# Altium schematic sheet [1]-MCU_LPC1777.SchDoc
size A3; SheetNumber: 2; SheetTotal: 8
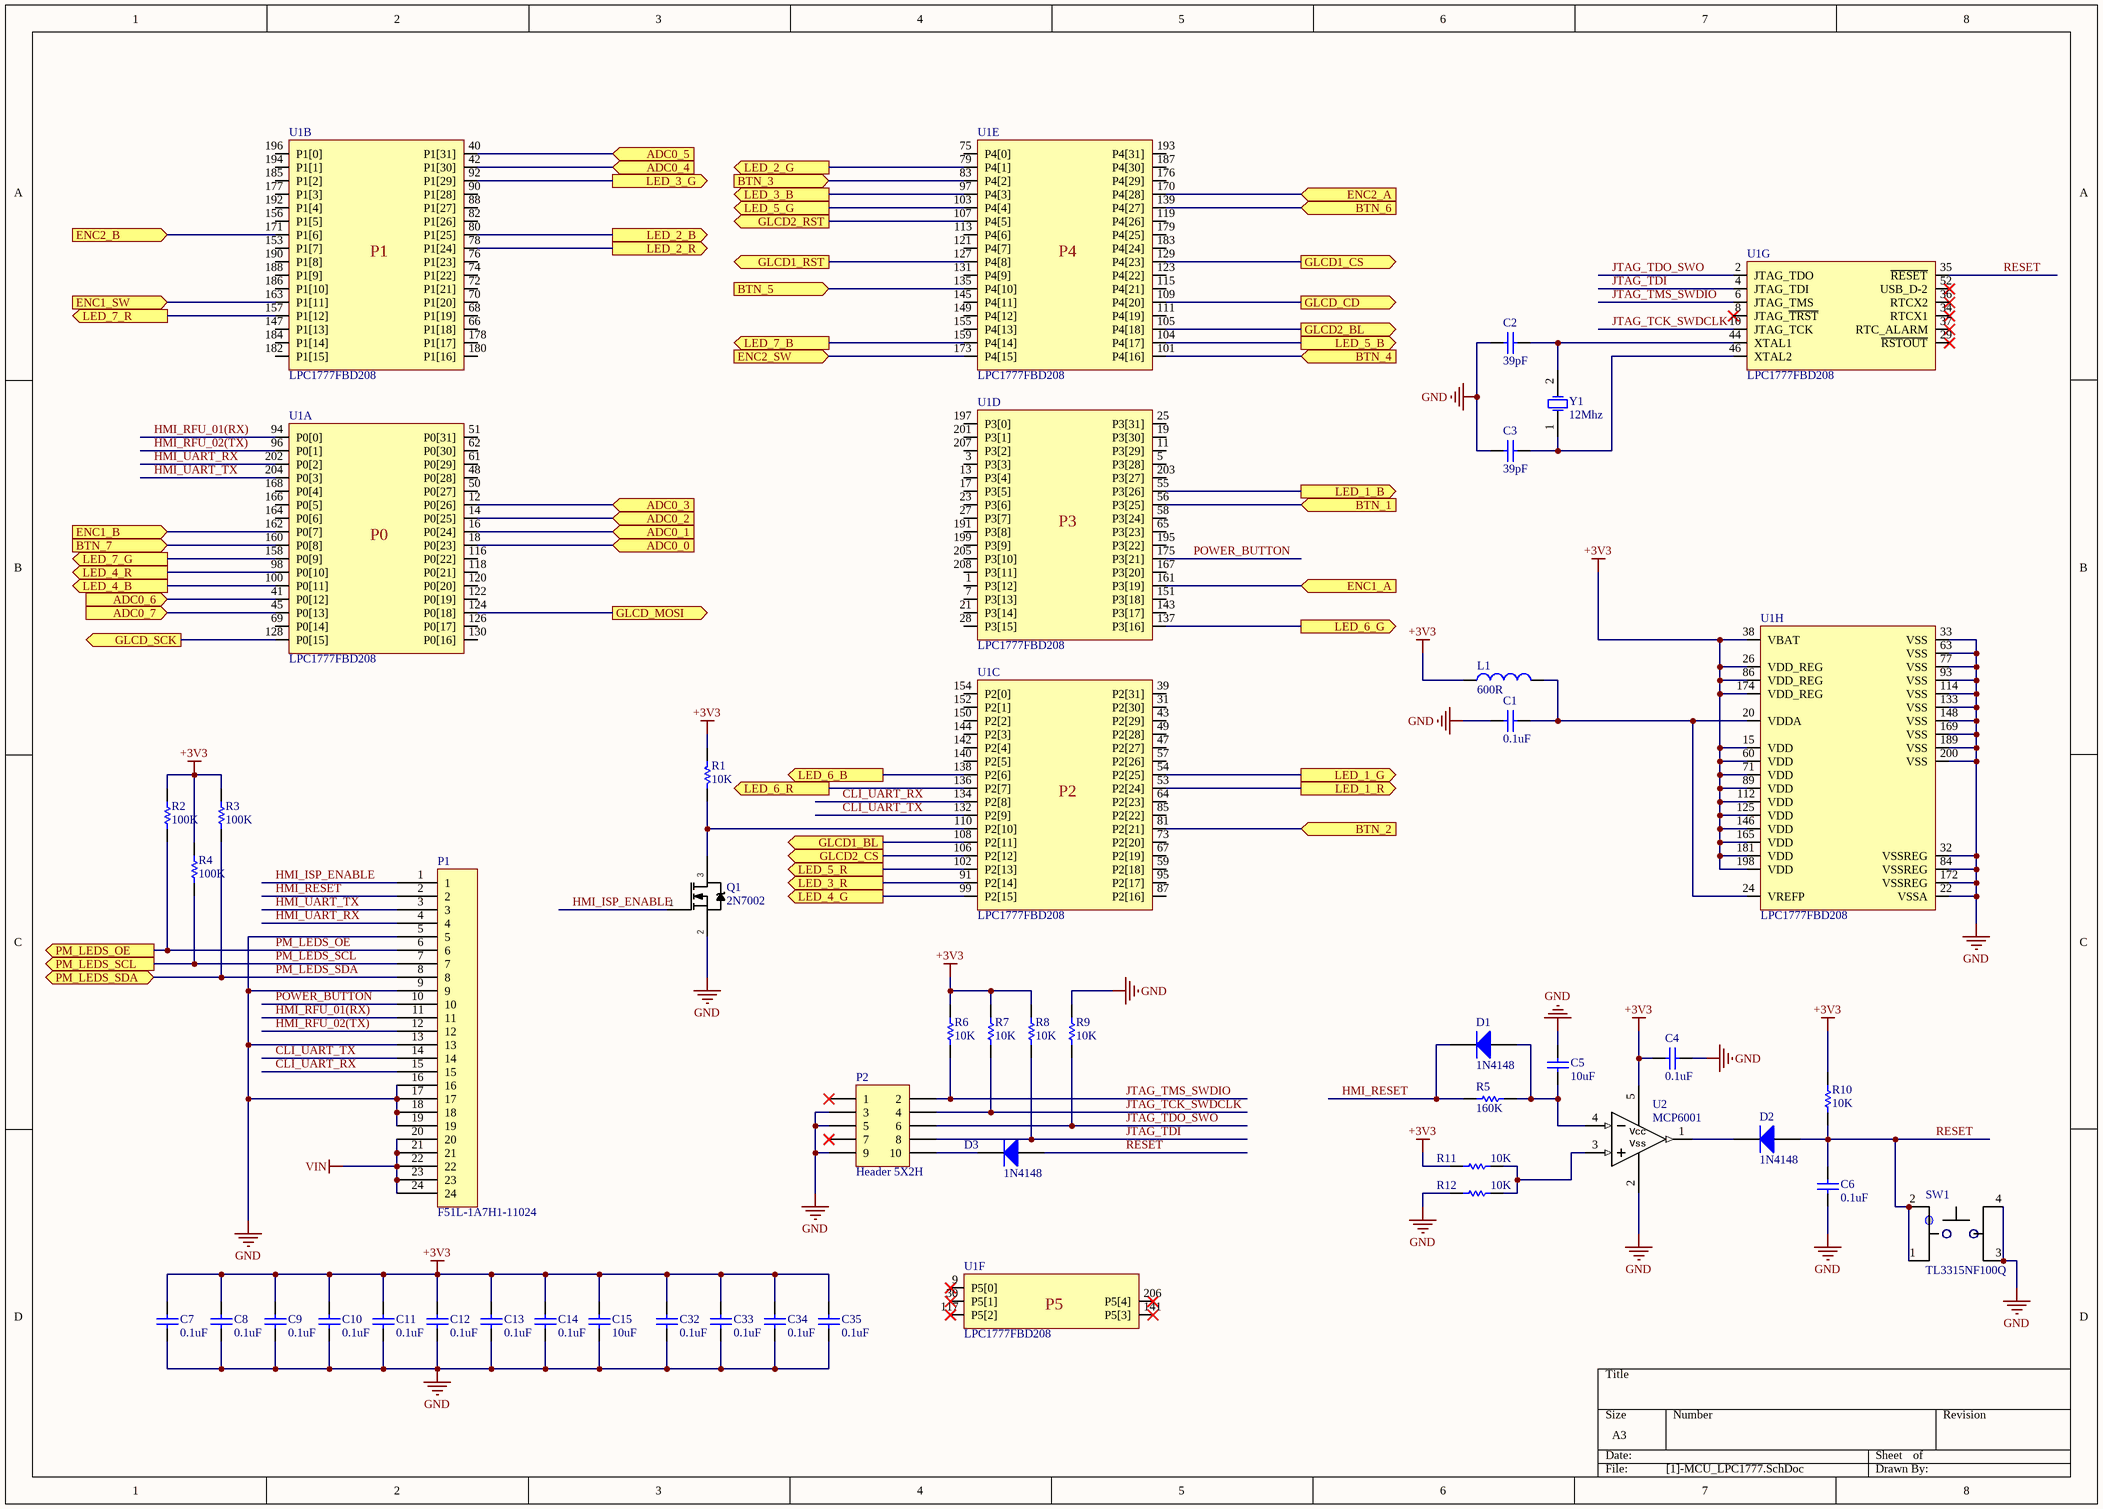
[diagram p0: [1]-MCU_LPC1777.SchDoc]

## Parts
C1  0.1uF  [CAPC1005N]
C2  39pF  [CAPC1608N]
C3  39pF  [CAPC1608N]
C4  0.1uF  [CAPC1608N]
C5  10uF  [CAPC1608N]
C6  0.1uF  [CAPC1608N]
C7  0.1uF  [CAPC1005N]
C8  0.1uF  [CAPC1005N]
C9  0.1uF  [CAPC1005N]
C10  0.1uF  [CAPC1005N]
C11  0.1uF  [CAPC1005N]
C12  0.1uF  [CAPC1005N]
C13  0.1uF  [CAPC1005N]
C14  0.1uF  [CAPC1005N]
C15  10uF  [CAPC1608N]
C32  0.1uF  [CAPC1005N]
C33  0.1uF  [CAPC1005N]
C34  0.1uF  [CAPC1005N]
C35  0.1uF  [CAPC1005N]
D1  1N4148  [SOD-323]
D2  1N4148  [SOD-323]
D3  1N4148  [SOD-323]
L1  600R  [INDC1608N]
P1  F51L-1A7H1-11024  [F51L-1A7H1-11024]
P2  Header 5X2H  [HDR2x5_1P27]
Q1  2N7002  [SOT23-3N]
R1  10K  [RESC1608N]
R2  100K  [RESC1608N]
R3  100K  [RESC1608N]
R4  100K  [RESC1608N]
R5  160K  [RESC1608N]
R6  10K  [RESC1608N]
R7  10K  [RESC1608N]
R8  10K  [RESC1608N]
R9  10K  [RESC1608N]
R10  10K  [RESC1608N]
R11  10K  [RESC1608N]
R12  10K  [RESC1608N]
SW1  TL3315NF100Q  [TL3315]
U1  LPC1777FBD208  [LQFP-208]  (parts A,B,C,D,E,F,G,H of 8)
U2  MCP6001  [SOT23-5N]
Y1  12Mhz  [CRYSTAL_HC49SDLF]

## Ports
ADC0_0 (in), ADC0_1 (in), ADC0_2 (in), ADC0_3 (in), ADC0_4 (in), ADC0_5 (in), ADC0_6 (in), ADC0_7 (in), BTN_1 (in), BTN_2 (in), BTN_3 (in), BTN_4 (in), BTN_5 (in), BTN_6 (in), BTN_7 (in), ENC1_A (in), ENC1_B (in), ENC1_SW (in), ENC2_A (in), ENC2_B (in), ENC2_SW (in), GLCD1_BL (out), GLCD1_CS (out), GLCD1_RST (out), GLCD2_BL (out), GLCD2_CS (out), GLCD2_RST (out), GLCD_CD (out), GLCD_MOSI (out), GLCD_SCK (out), LED_1_B (out), LED_1_G (out), LED_1_R (out), LED_2_B (out), LED_2_G (out), LED_2_R (out), LED_3_B (out), LED_3_G (out), LED_3_R (out), LED_4_B (out), LED_4_G (out), LED_4_R (out), LED_5_B (out), LED_5_G (out), LED_5_R (out), LED_6_B (out), LED_6_G (out), LED_6_R (out), LED_7_B (out), LED_7_G (out), LED_7_R (out), PM_LEDS_OE (out), PM_LEDS_SCL (out), PM_LEDS_SDA (bidir)

## Nets
+3V3: C4.2 C7.2 C8.2 C9.2 C10.2 C11.2 C12.2 C13.2 C14.2 C15.2 C32.2 C33.2 C34.2 C35.2 L1.2 R1.1 R2.2 R3.2 R4.2 R6.1 R7.1 R8.1 R10.1 R11.2 U1.15(VDD) U1.26(VDD_REG) U1.38(VBAT) U1.60(VDD) U1.71(VDD) U1.86(VDD_REG) U1.89(VDD) U1.112(VDD) U1.125(VDD) U1.146(VDD) U1.165(VDD) U1.174(VDD_REG) U1.181(VDD) U1.198(VDD) U2.5(VCC)
GND: C1.2 C2.2 C3.1 C4.1 C5.1 C6.2 C7.1 C8.1 C9.1 C10.1 C11.1 C12.1 C13.1 C14.1 C15.1 C32.1 C33.1 C34.1 C35.1 P1.5 P1.9 P1.13 P1.16 P1.17 P1.18 P1.19 P2.3 P2.5 P2.9 Q1.2(S) R9.1 R12.2 SW1.3 SW1.4 U1.22(VSSA) U1.32(VSSREG) U1.33(VSS) U1.63(VSS) U1.77(VSS) U1.84(VSSREG) U1.93(VSS) U1.114(VSS) U1.133(VSS) U1.148(VSS) U1.169(VSS) U1.172(VSSREG) U1.189(VSS) U1.200(VSS) U2.2(VSS)
VIN: P1.20 P1.21 P1.22 P1.23 P1.24
ADC0_0: U1.18(P0[23]) ; port ADC0_0
ADC0_1: U1.16(P0[24]) ; port ADC0_1
ADC0_2: U1.14(P0[25]) ; port ADC0_2
ADC0_3: U1.12(P0[26]) ; port ADC0_3
ADC0_4: U1.42(P1[30]) ; port ADC0_4
ADC0_5: U1.40(P1[31]) ; port ADC0_5
ADC0_6: U1.41(P0[12]) ; port ADC0_6
ADC0_7: U1.45(P0[13]) ; port ADC0_7
BTN_1: U1.56(P3[25]) ; port BTN_1
BTN_2: U1.81(P2[21]) ; port BTN_2
BTN_3: U1.83(P4[2]) ; port BTN_3
BTN_4: U1.101(P4[16]) ; port BTN_4
BTN_5: U1.135(P4[10]) ; port BTN_5
BTN_6: U1.139(P4[27]) ; port BTN_6
BTN_7: U1.160(P0[8]) ; port BTN_7
CLI_UART_RX: P1.15 U1.134(P2[8])
CLI_UART_TX: P1.14 U1.132(P2[9])
ENC1_A: U1.161(P3[19]) ; port ENC1_A
ENC1_B: U1.162(P0[7]) ; port ENC1_B
ENC1_SW: U1.163(P1[11]) ; port ENC1_SW
ENC2_A: U1.170(P4[28]) ; port ENC2_A
ENC2_B: U1.171(P1[6]) ; port ENC2_B
ENC2_SW: U1.173(P4[15]) ; port ENC2_SW
GLCD1_BL: U1.108(P2[11]) ; port GLCD1_BL
GLCD1_CS: U1.129(P4[23]) ; port GLCD1_CS
GLCD1_RST: U1.127(P4[8]) ; port GLCD1_RST
GLCD2_BL: U1.105(P4[18]) ; port GLCD2_BL
GLCD2_CS: U1.106(P2[12]) ; port GLCD2_CS
GLCD2_RST: U1.107(P4[5]) ; port GLCD2_RST
GLCD_CD: U1.109(P4[20]) ; port GLCD_CD
GLCD_MOSI: U1.124(P0[18]) ; port GLCD_MOSI
GLCD_SCK: U1.128(P0[15]) ; port GLCD_SCK
HMI_ISP_ENABLE: P1.1 Q1.1(G)
HMI_RESET: D1.1(K) P1.2 R5.1
HMI_RFU_01(RX): P1.11 U1.94(P0[0])
HMI_RFU_02(TX): P1.12 U1.96(P0[1])
HMI_UART_RX: P1.4 U1.202(P0[2])
HMI_UART_TX: P1.3 U1.204(P0[3])
JTAG_TCK_SWDCLK: P2.4 R7.2 U1.10(JTAG_TCK)
JTAG_TDI: P2.8 R8.2 U1.4(JTAG_TDI)
JTAG_TDO_SWO: P2.6 R9.2 U1.2(JTAG_TDO)
JTAG_TMS_SWDIO: P2.2 R6.2 U1.6(JTAG_TMS)
LED_1_B: U1.55(P3[26]) ; port LED_1_B
LED_1_G: U1.54(P2[25]) ; port LED_1_G
LED_1_R: U1.53(P2[24]) ; port LED_1_R
LED_2_B: U1.80(P1[25]) ; port LED_2_B
LED_2_G: U1.79(P4[1]) ; port LED_2_G
LED_2_R: U1.78(P1[24]) ; port LED_2_R
LED_3_B: U1.97(P4[3]) ; port LED_3_B
LED_3_G: U1.92(P1[29]) ; port LED_3_G
LED_3_R: U1.91(P2[14]) ; port LED_3_R
LED_4_B: U1.100(P0[11]) ; port LED_4_B
LED_4_G: U1.99(P2[15]) ; port LED_4_G
LED_4_R: U1.98(P0[10]) ; port LED_4_R
LED_5_B: U1.104(P4[17]) ; port LED_5_B
LED_5_G: U1.103(P4[4]) ; port LED_5_G
LED_5_R: U1.102(P2[13]) ; port LED_5_R
LED_6_B: U1.138(P2[6]) ; port LED_6_B
LED_6_G: U1.137(P3[16]) ; port LED_6_G
LED_6_R: U1.136(P2[7]) ; port LED_6_R
LED_7_B: U1.159(P4[14]) ; port LED_7_B
LED_7_G: U1.158(P0[9]) ; port LED_7_G
LED_7_R: U1.157(P1[12]) ; port LED_7_R
PM_LEDS_OE: P1.6 R2.1 ; port PM_LEDS_OE
PM_LEDS_SCL: P1.7 R4.1 ; port PM_LEDS_SCL
PM_LEDS_SDA: P1.8 R3.1 ; port PM_LEDS_SDA
POWER_BUTTON: P1.10 U1.175(P3[21])
RESET: C6.1 D2.2(A) D3.2(A) R10.2 SW1.1 SW1.2 U1.35(~{RESET})
NetC1_1: C1.1 L1.1 U1.20(VDDA) U1.24(VREFP)
NetC2_1: C2.1 U1.44(XTAL1) Y1.2(OSC2)
NetC3_2: C3.2 U1.46(XTAL2) Y1.1(OSC1)
NetC5_2: C5.2 D1.2(A) R5.2 U2.4(IN-)
NetD2_1: D2.1(K) U2.1(OUT)
NetD3_1: D3.1(K) P2.10
NetQ1_3: Q1.3(D) R1.2 U1.110(P2[10])
NetR11_1: R11.1 R12.1 U2.3(IN+)

Not connected (* = marked no-connect by the designer): P2 1* 7*; U1 1(P3[12]) 3(P3[3]) 5(P3[28]) 7(P3[13]) 8(JTAG_~{TRST})* 9(P5[0])* 11(P3[29]) 13(P3[4]) 17(P3[5]) 19(P3[30]) 21(P3[14]) 23(P3[6]) 25(P3[31]) 27(P3[7]) 28(P3[15]) 29(~{RSTOUT})* 30(P5[1])* 31(P2[30]) 34(RTCX1)* 36(RTCX2)* 37(RTC_ALARM)* 39(P2[31]) 43(P2[29]) 47(P2[27]) 48(P0[28]) 49(P2[28]) 50(P0[27]) 51(P0[31]) 52(USB_D-2)* 57(P2[26]) 58(P3[24]) 59(P2[18]) 61(P0[29]) 62(P0[30]) 64(P2[23]) 65(P3[23]) 66(P1[18]) 67(P2[19]) 68(P1[19]) 69(P0[14]) 70(P1[20]) 72(P1[21]) 73(P2[20]) 74(P1[22]) 75(P4[0]) 76(P1[23]) 82(P1[26]) 85(P2[22]) 87(P2[16]) 88(P1[27]) 90(P1[28]) 95(P2[17]) 111(P4[19]) 113(P4[6]) 115(P4[21]) 116(P0[22]) 117(P5[2])* 118(P0[21]) 119(P4[26]) 120(P0[20]) 121(P4[7]) 122(P0[19]) 123(P4[22]) 126(P0[17]) 130(P0[16]) 131(P4[9]) 140(P2[5]) 141(P5[3])* 142(P2[4]) 143(P3[17]) 144(P2[3]) 145(P4[11]) 147(P1[13]) 149(P4[12]) 150(P2[2]) 151(P3[18]) 152(P2[1]) 153(P1[7]) 154(P2[0]) 155(P4[13]) 156(P1[5]) 164(P0[6]) 166(P0[5]) 167(P3[20]) 168(P0[4]) 176(P4[29]) 177(P1[3]) 178(P1[17]) 179(P4[25]) 180(P1[16]) 182(P1[15]) 183(P4[24]) 184(P1[14]) 185(P1[2]) 186(P1[10]) 187(P4[30]) 188(P1[9]) 190(P1[8]) 191(P3[8]) 192(P1[4]) 193(P4[31]) 194(P1[1]) 195(P3[22]) 196(P1[0]) 197(P3[0]) 199(P3[9]) 201(P3[1]) 203(P3[27]) 205(P3[10]) 206(P5[4])* 207(P3[2]) 208(P3[11])

## Notes on the sheet
- (in symbol IC_LPC1777FBD208,551, part A) P0
- (in symbol IC_LPC1777FBD208,551, part B) P1
- (in symbol IC_LPC1777FBD208,551, part C) P2
- (in symbol IC_LPC1777FBD208,551, part D) P3
- (in symbol IC_LPC1777FBD208,551, part E) P4
- (in symbol IC_LPC1777FBD208,551, part F) P5
- (in symbol IC_MCP6001T-I/OT) Vcc; Vss

## Library data of the parts
C1 C7-C14 C32-C35 = GRM155R71H104KE14D: CAP CER 0.1UF 50V X7R 0402; Manufacturer 1: Murata; Description 1: Cap Ceramic 0.1uF 50V X7R 10% SMD 0402 125C Paper T/R; Voltage Rating DC: 50 VDC; Tolerance: 10 %; Brand: Murata Electronics; Capacitance - nF: 100 nF; Capacitance - pF: 100000 pF; Class: Class 2; Type: General Purpose Ceramic Capacitors; Unit Weight: 0.000212 oz; Supplier 1: Digi-Key; Manufacturer Part Number 1: GRM155R71H104KE14D; Stock 1: 0; Pricing 1: 1=0.1, 10=0.022, 100=0.0099, 500=0.0071, 1000=0.0056, 2500=0.0051, 5000=0.0047 (USD); Product Category: Multilayer Ceramic Capacitors MLCC - SMD/SMT; RoHS: True; Capacitance: 0.1 uF; Dielectric: X7R; Case Code - in: 0402; Case Code - mm: 1005; Height: 0.5 mm; Maximum Operating Temperature: + 125 C; Minimum Operating Temperature: - 55 C; Product: General Type MLCCs; Series: GRM; Packaging: Reel; Length: 1 mm; Package / Case: 0402 (1005 metric); Factory Pack Quantity: 10000; Termination Style: SMD/SMT; Width: 0.5 mm; ComponentLink1URL: http://components.arrow.com/part/dataview/0323_07030614; ComponentLink1Description: http://components.arrow.com/part/dataview/0323_07030614; ComponentLink2URL: http://psearch.en.murata.com/capacitor/product/GRM155R71H104KE14%23.pdf; ComponentLink2Description: http://psearch.en.murata.com/capacitor/product/GRM155R71H104KE14%23.pdf; ComponentLink3URL: http://www.mouser.com/ds/2/281/c02e-2905.pdf; ComponentLink3Description: http://www.mouser.com/ds/2/281/c02e-2905.pdf; ComponentLink4URL: http://search.murata.co.jp/Ceramy/image/img/A01X/partnumbering_e_01.pdf; ComponentLink4Description: http://search.murata.co.jp/Ceramy/image/img/A01X/partnumbering_e_01.pdf; ComponentLink5URL: http://www.farnell.com/datasheets/2079156.pdf; ComponentLink5Description: http://www.farnell.com/datasheets/2079156.pdf; Supplier Part Number 1: 490-10700-1-ND
C2 C3 = C1608NP01H390J080AA: CAP CER 39PF 50V NP0 0603; Manufacturer 1: TDK; Tolerance: 5%; Dielectric: C0G; Supplier 1: Digi-Key; Manufacturer Part Number 1: C1608NP01H390J080AA; Stock 1: 1503; Pricing 1: 1=0.15, 10=0.106, 100=0.05, 500=0.03508, 1000=0.02904 (USD); Mount: Surface Mount; Case/Package: 0603; Weight: 7.1E-05oz; Case Code (Metric): 1608; Case Code (Imperial): 0603; Min Operating Temperature: -55°C; Max Operating Temperature: 150°C; Package Quantity: 4000; Packaging: Tape and Reel; Capacitance: 39pF; Voltage Rating: 50V; Termination: SMD/SMT; Voltage Rating (DC): 50V; Length: 0.063inch; Height: 0.8mm; Width: 0.031inch; Thickness: 0.035inch; Supplier Part Number 1: 445-14077-1-ND
C4 C6 = CC0603KRX7R8BB104: CAP CER 0.1UF 25V X7R 0603; Manufacturer 1: Yageo; Capacitance: 100nF; Tolerance: 10%; Supplier 1: Digi-Key; Manufacturer Part Number 1: CC0603KRX7R8BB104; Stock 1: 40000; Pricing 1: 1=0.1, 10=0.074, 100=0.0329, 500=0.02352, 1000=0.01848 (USD); Mount: Surface Mount; Case/Package: 0603; Number of Pins: 2; Case Code (Imperial): 0603; Case Code (Metric): 1608; Min Operating Temperature: -55°C; Max Operating Temperature: 125°C; Dielectric: X7R; Voltage Rating: 25V; Packaging: Tape and Reel; Package Quantity: 1; Voltage Rating (DC): 25V; Termination: SMD/SMT; Composition: Ceramic; Voltage: 25V; Length: 1.6mm; Height: 0.8mm; Width: 0.8mm; Thickness: 0.035inch; Depth: 0.8mm; Radiation Hardening: No; REACH SVHC: Unknown; Lead Free: Lead Free; Halogen Free: Halogen Free; ComponentLink1URL: https://datasheet.ciiva.com/11786/0900766b80c10176-11786120.pdf; ComponentLink1Description: https://datasheet.ciiva.com/11786/0900766b80c10176-11786120.pdf; ComponentLink2URL: https://datasheet.ciiva.com/144/mlccorderingcode-144075.pdf; ComponentLink2Description: https://datasheet.ciiva.com/144/mlccorderingcode-144075.pdf; ComponentLink3URL: https://datasheet.ciiva.com/17434/upy-gphc-x7r-6-3v-to-50v-8-17434263.pdf; ComponentLink3Description: https://datasheet.ciiva.com/17434/upy-gphc-x7r-6-3v-to-50v-8-17434263.pdf; ComponentLink4URL: https://datasheet.ciiva.com/26829/getdatasheetpartid-403577-26829431.pdf; ComponentLink4Description: https://datasheet.ciiva.com/26829/getdatasheetpartid-403577-26829431.pdf; ComponentLink5URL: https://datasheet.ciiva.com/11587/upy-gphc-x7r-6-3v-to-50v-8-11587208.pdf; ComponentLink5Description: https://datasheet.ciiva.com/11587/upy-gphc-x7r-6-3v-to-50v-8-11587208.pdf; ComponentLink6URL: https://datasheet.ciiva.com/13389/upy-gphc-x7r-6-3v-to-50v-8-13389352.pdf; ComponentLink6Description: https://datasheet.ciiva.com/13389/upy-gphc-x7r-6-3v-to-50v-8-13389352.pdf; ComponentLink7URL: https://datasheet.ciiva.com/28450/1489800-28450584.pdf; ComponentLink7Description: https://datasheet.ciiva.com/28450/1489800-28450584.pdf; ComponentLink8URL: https://datasheet.ciiva.com/144/mlccorderingcode-144073.pdf; ComponentLink8Description: https://datasheet.ciiva.com/144/mlccorderingcode-144073.pdf; ComponentLink9URL: https://datasheet.ciiva.com/144/mlccorderingcode-144074.pdf; ComponentLink9Description: https://datasheet.ciiva.com/144/mlccorderingcode-144074.pdf; ComponentLink10URL: https://datasheet.ciiva.com/7978/1489800-7978155.pdf; ComponentLink10Description: https://datasheet.ciiva.com/7978/1489800-7978155.pdf; Supplier Part Number 1: 311-1341-1-ND
C5 C15 = GRM188R61A106KE69D: CAP CER 10UF 10V X5R 0603; Manufacturer 1: Murata; Tolerance: 10%; Supplier 1: Digi-Key; Manufacturer Part Number 1: GRM188R61A106KE69D; Stock 1: 40000; Pricing 1: 1=0.22, 10=0.149, 100=0.0754, 500=0.05158, 1000=0.04563 (USD); Mount: Surface Mount; Case/Package: 0603; Case Code (Metric): 1608; Case Code (Imperial): 0603; Min Operating Temperature: -55°C; Max Operating Temperature: 85°C; Capacitance: 10uF; Packaging: Tape and Reel; Dielectric: X5R; Voltage Rating: 10V; Voltage: 10V; Voltage Rating (DC): 10V; Length: 1.6mm; Height: 0.8mm; Width: 0.031inch; Thickness: 0.037inch; Depth: 0.8mm; REACH SVHC: No SVHC; Lead Free: Lead Free; Supplier Part Number 1: 490-10474-1-ND
D1-D3 = 1N4148WS-7-F: DIODE SWITCHING 75V 0.15A SOD323; Manufacturer 1: Diodes; Forward Current: 300mA; Reverse Recovery Time: 4ns; Element Configuration: Single; Forward Voltage: 1.25V; Peak Reverse Current: 1uA; Peak Non-Repetitive Surge Current: 2A; Average Rectified Current: 150mA; Power Dissipation: 200mW; Polarity: Standard; Capacitance: 2pF; Supplier 1: Digi-Key; Manufacturer Part Number 1: 1N4148WS-7-F; Stock 1: 557451; Pricing 1: 1=0.19, 10=0.171, 100=0.0932, 500=0.05736, 1000=0.03911 (USD); Mount: Surface Mount; Number of Pins: 2; Weight: 0.000173oz; Contact Plating: Tin,Matte; Min Operating Temperature: -65°C; Max Operating Temperature: 150°C; Max Repetitive Reverse Voltage (Vrrm): 75V; Max Forward Surge Current (Ifsm): 2A; Max Surge Current: 2A; Packaging: Tape and Reel; Recovery Time: 4ns; Package Quantity: 3000; Voltage Rating (DC): 75V; Power Rating: 200mW; Current Rating: 150mA; Output Current: 150mA; Voltage: 75V; Max Reverse Voltage (DC): 75V; Current: 2A; Length: 1.8mm; Height: 1mm; Width: 1.4mm; Radiation Hardening: No; REACH SVHC: No SVHC; Lead Free: Lead Free; ComponentLink1URL: https://datasheet.ciiva.com/16199/ds30097-16199061.pdf; ComponentLink1Description: https://datasheet.ciiva.com/16199/ds30097-16199061.pdf; ComponentLink2URL: https://datasheet.ciiva.com/16472/ds30097-16472599.pdf; ComponentLink2Description: https://datasheet.ciiva.com/16472/ds30097-16472599.pdf; ComponentLink3URL: https://datasheet.ciiva.com/1179/ds30097-1179355.pdf; ComponentLink3Description: https://datasheet.ciiva.com/1179/ds30097-1179355.pdf; ComponentLink4URL: https://datasheet.ciiva.com/8300/ds30097-8300396.pdf; ComponentLink4Description: https://datasheet.ciiva.com/8300/ds30097-8300396.pdf; ComponentLink5URL: https://datasheet.ciiva.com/911/ds30097-911741.pdf; ComponentLink5Description: https://datasheet.ciiva.com/911/ds30097-911741.pdf; ComponentLink6URL: https://datasheet.ciiva.com/911/ds30097-911742.pdf; ComponentLink6Description: https://datasheet.ciiva.com/911/ds30097-911742.pdf; ComponentLink7URL: https://datasheet.ciiva.com/25946/ds30097-25946926.pdf; ComponentLink7Description: https://datasheet.ciiva.com/25946/ds30097-25946926.pdf; ComponentLink8URL: https://datasheet.ciiva.com/911/ds30097-911743.pdf; ComponentLink8Description: https://datasheet.ciiva.com/911/ds30097-911743.pdf; Supplier Part Number 1: 1N4148WS-FDICT-ND
L1 = 742792651: FERRITE BEAD 600 OHM 1.0A 0603; Manufacturer 1: Wurth Electronics; Tolerance: 25%; Current Rating: 1A; Number of Lines: 1; DC Resistance (DCR): 200mR; Test Frequency: 100MHz; Inductance: 0.36h; Supplier 1: Digi-Key; Manufacturer Part Number 1: 742792651; Description 1: FERRITE BEAD 600 OHM 1.0A 0603; Stock 1: 281795; Pricing 1: 1=0.17, 50=0.168, 100=0.155, 500=0.148, 1000=0.141, 2000=0.134 (USD); Mount: Surface Mount; Case/Package: SMD/SMT; Weight: 0.000141oz; Case Code (Metric): 1608; Case Code (Imperial): 0603; Material: Ferrite; Core Material: Ferrite; Min Operating Temperature: -55°C; Max Operating Temperature: 125°C; Package Quantity: 1; Packaging: Tape and Reel; Impedance: 600R; Max Current Rating: 1A; Max DC Current: 1A; Termination: SMD/SMT; Resistance: 200mR; Length: 1.6mm; Height: 0.8mm; Width: 0.8mm; Depth: 0.8mm; REACH SVHC: Unknown; Lead Free: Lead Free; ComponentLink1URL: https://datasheet.ciiva.com/11803/0900766b80d2e079-11803680.pdf; ComponentLink1Description: https://datasheet.ciiva.com/11803/0900766b80d2e079-11803680.pdf; ComponentLink2URL: https://datasheet.ciiva.com/1475/1705833-1475349.pdf; ComponentLink2Description: https://datasheet.ciiva.com/1475/1705833-1475349.pdf; ComponentLink3URL: https://datasheet.ciiva.com/1013/742792651-1013527.pdf; ComponentLink3Description: https://datasheet.ciiva.com/1013/742792651-1013527.pdf; ComponentLink4URL: https://datasheet.ciiva.com/4940/742792651-72243-4940492.pdf; ComponentLink4Description: https://datasheet.ciiva.com/4940/742792651-72243-4940492.pdf; ComponentLink5URL: https://datasheet.ciiva.com/1013/742792651-1013528.pdf; ComponentLink5Description: https://datasheet.ciiva.com/1013/742792651-1013528.pdf; ComponentLink6URL: https://datasheet.ciiva.com/1013/742792651-1013529.pdf; ComponentLink6Description: https://datasheet.ciiva.com/1013/742792651-1013529.pdf; ComponentLink7URL: https://datasheet.ciiva.com/22711/1705833-22711420.pdf; ComponentLink7Description: https://datasheet.ciiva.com/22711/1705833-22711420.pdf; Supplier Part Number 1: 732-1593-6-ND
P1 = F51L-1A7H1-11024: FLEX CONNECTOR, 1.00MM PITCH, HE; Manufacturer 1: Amphenol ICC / FCI; Supplier 1: Digi-Key; Manufacturer Part Number 1: F51L-1A7H1-11024; Category: FFC / FPC; Stock 1: 1646; Pricing 1: 1=0.77000, 10=0.67500, 25=0.61680, 50=0.58060, 100=0.55640, 250=0.50804, 500=0.48384 (USD); Supplier Part Number 1: 609-F51L-1A7H1-11024CT-ND
P2 = Header 5X2H: Header, 5-Pin, Dual row, Right Angle; LatestRevisionDate: 17-Jul-2002; LatestRevisionNote: Re-released for DXP Platform.; Publisher: Altium Limited
Q1 = 2N7002: MOSFET N-CH 60V 115MA SOT-23; Manufacturer 1: ON Semiconductor / Fairchild; Max Power Dissipation: 200mW; Drain to Source Resistance: 1.2R; Gate to Source Voltage (Vgs): 20V; Nominal Vgs: 2.1V; Number of Elements: 1; Element Configuration: Single; Input Capacitance: 50pF; Rds On Max: 7.5R; On-State Resistance: 5.3R; Supplier 1: Digi-Key; Manufacturer Part Number 1: 2N7002; Stock 1: 111118; Pricing 1: 1=0.33, 10=0.304, 100=0.17, 500=0.09108, 1000=0.06193 (USD); Mount: Surface Mount; Case/Package: SOT-23; Number of Pins: 3; Contact Plating: Tin,Matte; Min Operating Temperature: -55°C; Max Operating Temperature: 150°C; Continuous Drain Current (ID): 115mA; Packaging: Tape and Reel; Package Quantity: 1; Drain to Source Voltage (Vdss): 60V; Drain to Source Breakdown Voltage: 60V; Power Dissipation: 200mW; Threshold Voltage: 2.1V; Voltage Rating (DC): 60V; Current Rating: 115mA; Dual Supply Voltage: 60V; Current: 115mA; Voltage: 60V; Length: 2.92mm; Height: 0.93mm; Width: 3.05mm; Radiation Hardening: No; REACH SVHC: No SVHC; Lead Free: Lead Free; ComponentLink1URL: https://datasheet.ciiva.com/931/2n7000-931777.pdf; ComponentLink1Description: https://datasheet.ciiva.com/931/2n7000-931777.pdf; ComponentLink2URL: https://datasheet.ciiva.com/27746/47-0120-27746881.pdf; ComponentLink2Description: https://datasheet.ciiva.com/27746/47-0120-27746881.pdf; ComponentLink3URL: https://datasheet.ciiva.com/1254/2n7002-1254451.pdf; ComponentLink3Description: https://datasheet.ciiva.com/1254/2n7002-1254451.pdf; ComponentLink4URL: https://datasheet.ciiva.com/15137/getdatasheetpartid-93547-15137771.pdf; ComponentLink4Description: https://datasheet.ciiva.com/15137/getdatasheetpartid-93547-15137771.pdf; ComponentLink5URL: https://datasheet.ciiva.com/931/2n7000-931762.pdf; ComponentLink5Description: https://datasheet.ciiva.com/931/2n7000-931762.pdf; ComponentLink6URL: https://datasheet.ciiva.com/931/2n7000-931763.pdf; ComponentLink6Description: https://datasheet.ciiva.com/931/2n7000-931763.pdf; ComponentLink7URL: https://datasheet.ciiva.com/931/2n7000-931764.pdf; ComponentLink7Description: https://datasheet.ciiva.com/931/2n7000-931764.pdf; ComponentLink8URL: https://datasheet.ciiva.com/1254/660093-1254452.pdf; ComponentLink8Description: https://datasheet.ciiva.com/1254/660093-1254452.pdf; ComponentLink9URL: https://datasheet.ciiva.com/1188/660093-1188359.pdf; ComponentLink9Description: https://datasheet.ciiva.com/1188/660093-1188359.pdf; ComponentLink10URL: https://datasheet.ciiva.com/1188/660093-1188361.pdf; ComponentLink10Description: https://datasheet.ciiva.com/1188/660093-1188361.pdf; ComponentLink11URL: https://datasheet.ciiva.com/17007/2n7002-17007243.pdf; ComponentLink11Description: https://datasheet.ciiva.com/17007/2n7002-17007243.pdf; ComponentLink12URL: https://datasheet.ciiva.com/3304/nds7002a-3304380.pdf; ComponentLink12Description: https://datasheet.ciiva.com/3304/nds7002a-3304380.pdf; ComponentLink13URL: https://datasheet.ciiva.com/3304/nds7002a-3304381.pdf; ComponentLink13Description: https://datasheet.ciiva.com/3304/nds7002a-3304381.pdf; ComponentLink14URL: https://datasheet.ciiva.com/22655/660093-22655230.pdf; ComponentLink14Description: https://datasheet.ciiva.com/22655/660093-22655230.pdf; Supplier Part Number 1: 2N7002NCT-ND
R1 R6-R12 = AC0603JR-0710KL: RES SMD 10K OHM 5% 1/10W 0603; Manufacturer 1: Yageo; Voltage Rating: 50V; Resistance: 10kR; Power Rating: 100mW; Temperature Coefficient: 100ppm/°C; Supplier 1: Digi-Key; Manufacturer Part Number 1: AC0603JR-0710KL; Stock 1: 60451; Pricing 1: 1=0.1, 10=0.032, 100=0.0131, 1000=0.00588, 2500=0.0051 (USD); Case/Package: 0603; Case Code (Imperial): 0603; Case Code (Metric): 1608; Min Operating Temperature: -55°C; Max Operating Temperature: 155°C; Packaging: Tape and Reel; Tolerance: 5%; Package Quantity: 1; Composition: Thick Film; Termination: SMD/SMT; Number of Terminations: 2; Military Standard: Not; Max Power Dissipation: 100mW; Features: Moisture Resistant,Automotive AEC-Q200,Anti-Sulfur; Length: 0.063inch; Height: 0.022inch; Width: 0.031inch; Depth: 0.8mm; Lead Free: Lead Free; ComponentLink1URL: https://datasheet.ciiva.com/5562/pyu-ac-51-rohs-l-2-5562553.pdf; ComponentLink1Description: https://datasheet.ciiva.com/5562/pyu-ac-51-rohs-l-2-5562553.pdf; Supplier Part Number 1: 311-10KLECT-ND
R2-R4 = ESR03EZPJ104: RES SMD 100K OHM 5% 1/4W 0603; Manufacturer 1: Rohm; Resistance: 100kR; Power Rating: 200mW; Max Power Dissipation: 250mW; Temperature Coefficient: 200ppm/°C; Supplier 1: Digi-Key; Manufacturer Part Number 1: ESR03EZPJ104; Stock 1: 17901; Pricing 1: 1=0.1, 10=0.087, 100=0.0333, 1000=0.01464, 2500=0.01264 (USD); Case/Package: 0603; Case Code (Metric): 1608; Case Code (Imperial): 0603; Min Operating Temperature: -55°C; Max Operating Temperature: 155°C; Tolerance: 5%; Package Quantity: 1; Packaging: Cut Tape; Composition: Thick Film; Number of Terminations: 2; Length: 0.063inch; Height: 0.022inch; Width: 0.031inch; Lead Free: Lead Free; ComponentLink1URL: https://datasheet.ciiva.com/14930/esr-14930633.pdf; ComponentLink1Description: https://datasheet.ciiva.com/14930/esr-14930633.pdf; ComponentLink2URL: https://datasheet.ciiva.com/14924/esr-14924811.pdf; ComponentLink2Description: https://datasheet.ciiva.com/14924/esr-14924811.pdf; ComponentLink3URL: https://datasheet.ciiva.com/14928/esr-14928813.pdf; ComponentLink3Description: https://datasheet.ciiva.com/14928/esr-14928813.pdf; Supplier Part Number 1: RHM100KDCT-ND
R5 = RMCF0603JT160K: RES SMD 160K OHM 5% 1/10W 0603; Manufacturer 1: Stackpole Electronics; Resistance: 160kR; Power Rating: 100mW; Temperature Coefficient: 100ppm/°C; Supplier 1: Digi-Key; Manufacturer Part Number 1: RMCF0603JT160K; Stock 1: 10640; Pricing 1: 1=0.1, 10=0.016, 100=0.0064, 1000=0.00289, 2500=0.0025 (USD); Mount: Surface Mount; Case/Package: 0603; Case Code (Metric): 1608; Case Code (Imperial): 0603; Contact Plating: Tin,Matte; Min Operating Temperature: -55°C; Max Operating Temperature: 155°C; Tolerance: 5%; Packaging: Tape and Reel; Composition: Thick Film; Number of Terminations: 2; Max Power Dissipation: 100mW; Features: Automotive AEC-Q200; Length: 0.061inch; Height: 0.022inch; Width: 0.031inch; Radiation Hardening: No; Lead Free: Lead Free; Supplier Part Number 1: RMCF0603JT160KCT-ND
SW1 = TL3315NF100Q: SWITCH TACTILE SPST-NO 0.05A 15V; Manufacturer 1: E-Switch; Mechanical Life: 1000000Cycles; Operating Force: 100gf; Current Rating: 50mA; Throw Configuration: SPST; Contact Resistance: 200mR; Illumination Type: Non-Illuminated; Switch Travel: 0.2mm; Switch Function: Off-Mom; Actuator Length: 0mm; Supplier 1: Digi-Key; Supplier Part Number 1: EG4620CT-ND; Manufacturer Part Number 1: TL3315NF100Q; Stock 1: 699659; Pricing 1: 1=0.22, 10=0.214, 25=0.2064, 50=0.199, 100=0.1879, 250=0.17688, 500=0.16952, 1000=0.12898 (USD); Mount: Surface Mount; Case/Package: SMD/SMT; Colour: Yellow; Contact Plating: Silver; Contact Material: Silver; Min Operating Temperature: -20°C; Max Operating Temperature: 70°C; Packaging: Tape and Reel; Voltage Rating (DC): 15V; Package Quantity: 1; Max Voltage Rating (DC): 15V; Termination: Gull Wing; Electrical Life: 1000000Cycles; Orientation: Straight; Lead Free: Lead Free; ComponentLink1URL: https://datasheet.ciiva.com/2900/p010336b-2900756.pdf; ComponentLink1Description: https://datasheet.ciiva.com/2900/p010336b-2900756.pdf; ComponentLink2URL: https://datasheet.ciiva.com/5284/tl3315-7499-5284548.pdf; ComponentLink2Description: https://datasheet.ciiva.com/5284/tl3315-7499-5284548.pdf; ComponentLink3URL: https://datasheet.ciiva.com/2900/tl3315-2900757.pdf; ComponentLink3Description: https://datasheet.ciiva.com/2900/tl3315-2900757.pdf; ComponentLink4URL: https://datasheet.ciiva.com/2900/tl3315-2900758.pdf; ComponentLink4Description: https://datasheet.ciiva.com/2900/tl3315-2900758.pdf; ComponentLink5URL: https://datasheet.ciiva.com/16156/tl3315-16156332.pdf; ComponentLink5Description: https://datasheet.ciiva.com/16156/tl3315-16156332.pdf
U1 = IC_LPC1777FBD208,551: IC MCU 32BIT 512KB FLASH 208LQFP; Manufacturer 1: NXP Semiconductors; Min Supply Voltage: 2.4V; Max Supply Voltage: 3.6V; RAM Size: 96KB; Max Power Dissipation: 1.5W; Interface: CAN,EBI/EMI,I2C,I2S,MMC,SPI,SSP,UART,USART,USB; Number of I/Os: 165; Number of Timers/Counters: 4; Number of ADC Channels: 8; Operating Supply Voltage: 3.3V; Number of PWM Channels: 6; Frequency: 120MHz; Number of UART Channels: 5; Oscillator Type: Internal; Data Bus Width: 32b; Number of SPI Channels: 3; Watchdog Timer: Yes; Peripherals: Brown-out Detect/Reset,DMA,I2C,POR,PWM,WDT; Core Architecture: ARM; Supplier 1: Digi-Key; Manufacturer Part Number 1: LPC1777FBD208,551; Stock 1: 106; Pricing 1: 1=11.31, 36=9.96583, 108=8.78083, 504=7.81115, 1008=7.16471 (USD); Mount: Surface Mount; Case/Package: LQFP; Number of Pins: 208; Min Operating Temperature: -40°C; Max Operating Temperature: 85°C; Package Quantity: 36; Packaging: Tray; Number of Programmable I/O: 165; Max Frequency: 120MHz; Number of I2C Channels: 3; Memory Type: FLASH; Memory Size: 512KB; Length: 28.1mm; Height: 1.45mm; Width: 28.1mm; Radiation Hardening: No; REACH SVHC: No SVHC; Lead Free: Lead Free; ComponentLink1URL: http://www.farnell.com/datasheets/1859465.pdf; ComponentLink1Description: http://www.farnell.com/datasheets/1859465.pdf; ComponentLink2URL: http://www.nxp.com/documents/data_sheet/LPC178X_7X.pdf; ComponentLink2Description: http://www.nxp.com/documents/data_sheet/LPC178X_7X.pdf; Supplier Part Number 1: 568-7570-ND
U2 = IC_MCP6001T-I/OT: IC OPAMP GP 1MHZ RRO SOT23-5; Manufacturer 1: Microchip; Voltage Gain: 112dB; Min Supply Voltage: 1.8V; Max Supply Voltage: 6V; Common Mode Rejection Ratio: 60dB; Operating Supply Voltage: 5.5V; Slew Rate: 0.6V/µs; Nominal Supply Current: 100uA; Number of Channels: 1; Output Current: 23mA; Input Bias Current: 1pA; Input Offset Voltage (Vos): 4.5mV; Power Supply Rejection Ratio (PSRR): 86dB; Supplier 1: Digi-Key; Manufacturer Part Number 1: MCP6001T-I/OT; Stock 1: 3412; Pricing 1: 1=0.25, 25=0.206 (USD); Mount: Surface Mount; Case/Package: SOT-23; Number of Pins: 5; Contact Plating: Tin,Matte; Min Operating Temperature: -40°C; Max Operating Temperature: 85°C; Gain Bandwidth Product: 1MHz; Packaging: Tape and Reel; Bandwidth: 1MHz; Unity Gain Bandwidth Product: 1MHz; Package Quantity: 1; Number of Circuits: 1; Operating Supply Current: 100uA; Output Current per Channel: 23mA; Number of Elements: 1; Number of Amplifiers: 1; Voltage: 6V; Length: 3.1mm; Height: 1.3mm; Width: 1.8mm; Radiation Hardening: No; REACH SVHC: No SVHC; Lead Free: Lead Free; ComponentLink1URL: https://datasheet.ciiva.com/1793/21733j-1793040.pdf; ComponentLink1Description: https://datasheet.ciiva.com/1793/21733j-1793040.pdf; ComponentLink2URL: https://datasheet.ciiva.com/16199/filehandler-aspxddocname-en011705-16199408.pdf; ComponentLink2Description: https://datasheet.ciiva.com/16199/filehandler-aspxddocname-en011705-16199408.pdf; ComponentLink3URL: https://datasheet.ciiva.com/26344/651487-da-01-en-ic-opamp-mcp6001t-i-ot-sot-23-5-mcp-26344500.pdf; ComponentLink3Description: https://datasheet.ciiva.com/26344/651487-da-01-en-ic-opamp-mcp6001t-i-ot-sot-23-5-mcp-26344500.pdf; ComponentLink4URL: https://datasheet.ciiva.com/1793/21733j-1793041.pdf; ComponentLink4Description: https://datasheet.ciiva.com/1793/21733j-1793041.pdf; ComponentLink5URL: https://datasheet.ciiva.com/1793/21733j-1793042.pdf; ComponentLink5Description: https://datasheet.ciiva.com/1793/21733j-1793042.pdf; ComponentLink6URL: https://datasheet.ciiva.com/16796/jp011705-16796421.pdf; ComponentLink6Description: https://datasheet.ciiva.com/16796/jp011705-16796421.pdf; ComponentLink7URL: https://datasheet.ciiva.com/8078/524878-8078826.pdf; ComponentLink7Description: https://datasheet.ciiva.com/8078/524878-8078826.pdf; ComponentLink8URL: https://datasheet.ciiva.com/14544/70045422-14544795.pdf; ComponentLink8Description: https://datasheet.ciiva.com/14544/70045422-14544795.pdf; ComponentLink9URL: https://datasheet.ciiva.com/8078/524878-8078829.pdf; ComponentLink9Description: https://datasheet.ciiva.com/8078/524878-8078829.pdf; ComponentLink10URL: https://datasheet.ciiva.com/14151/mcp6001-2-4-eng-tds-14151487.pdf; ComponentLink10Description: https://datasheet.ciiva.com/14151/mcp6001-2-4-eng-tds-14151487.pdf; Supplier Part Number 1: MCP6001T-I/OTCT-ND
Y1 = FC4SDCBMF12.0-T1: CRYSTAL 12.0000MHZ 20PF SMD; Manufacturer 1: Fox Electronics; Supplier 1: Digi-Key; Manufacturer Part Number 1: FC4SDCBMF12.0-T1; Stock 1: 37233; Pricing 1: 1=0.32, 10=0.263, 50=0.2364, 100=0.2102, 500=0.1997 (USD); Supplier Part Number 1: 631-1013-1-ND